# EasyEDA Pro project ProPrj_StepCtlBoard_V1.2_2024-07-15.epro, schematic schematic1

## Sheets
1 P1: Create Date: 2024-05-13; Page Name: P1; Project Name: StepCtlBoard_V1.2; Schematic Name: schematic1; Update Date: 2024-05-18; Company: 嘉立创EDA; Page Size: A4; Version: V1.0
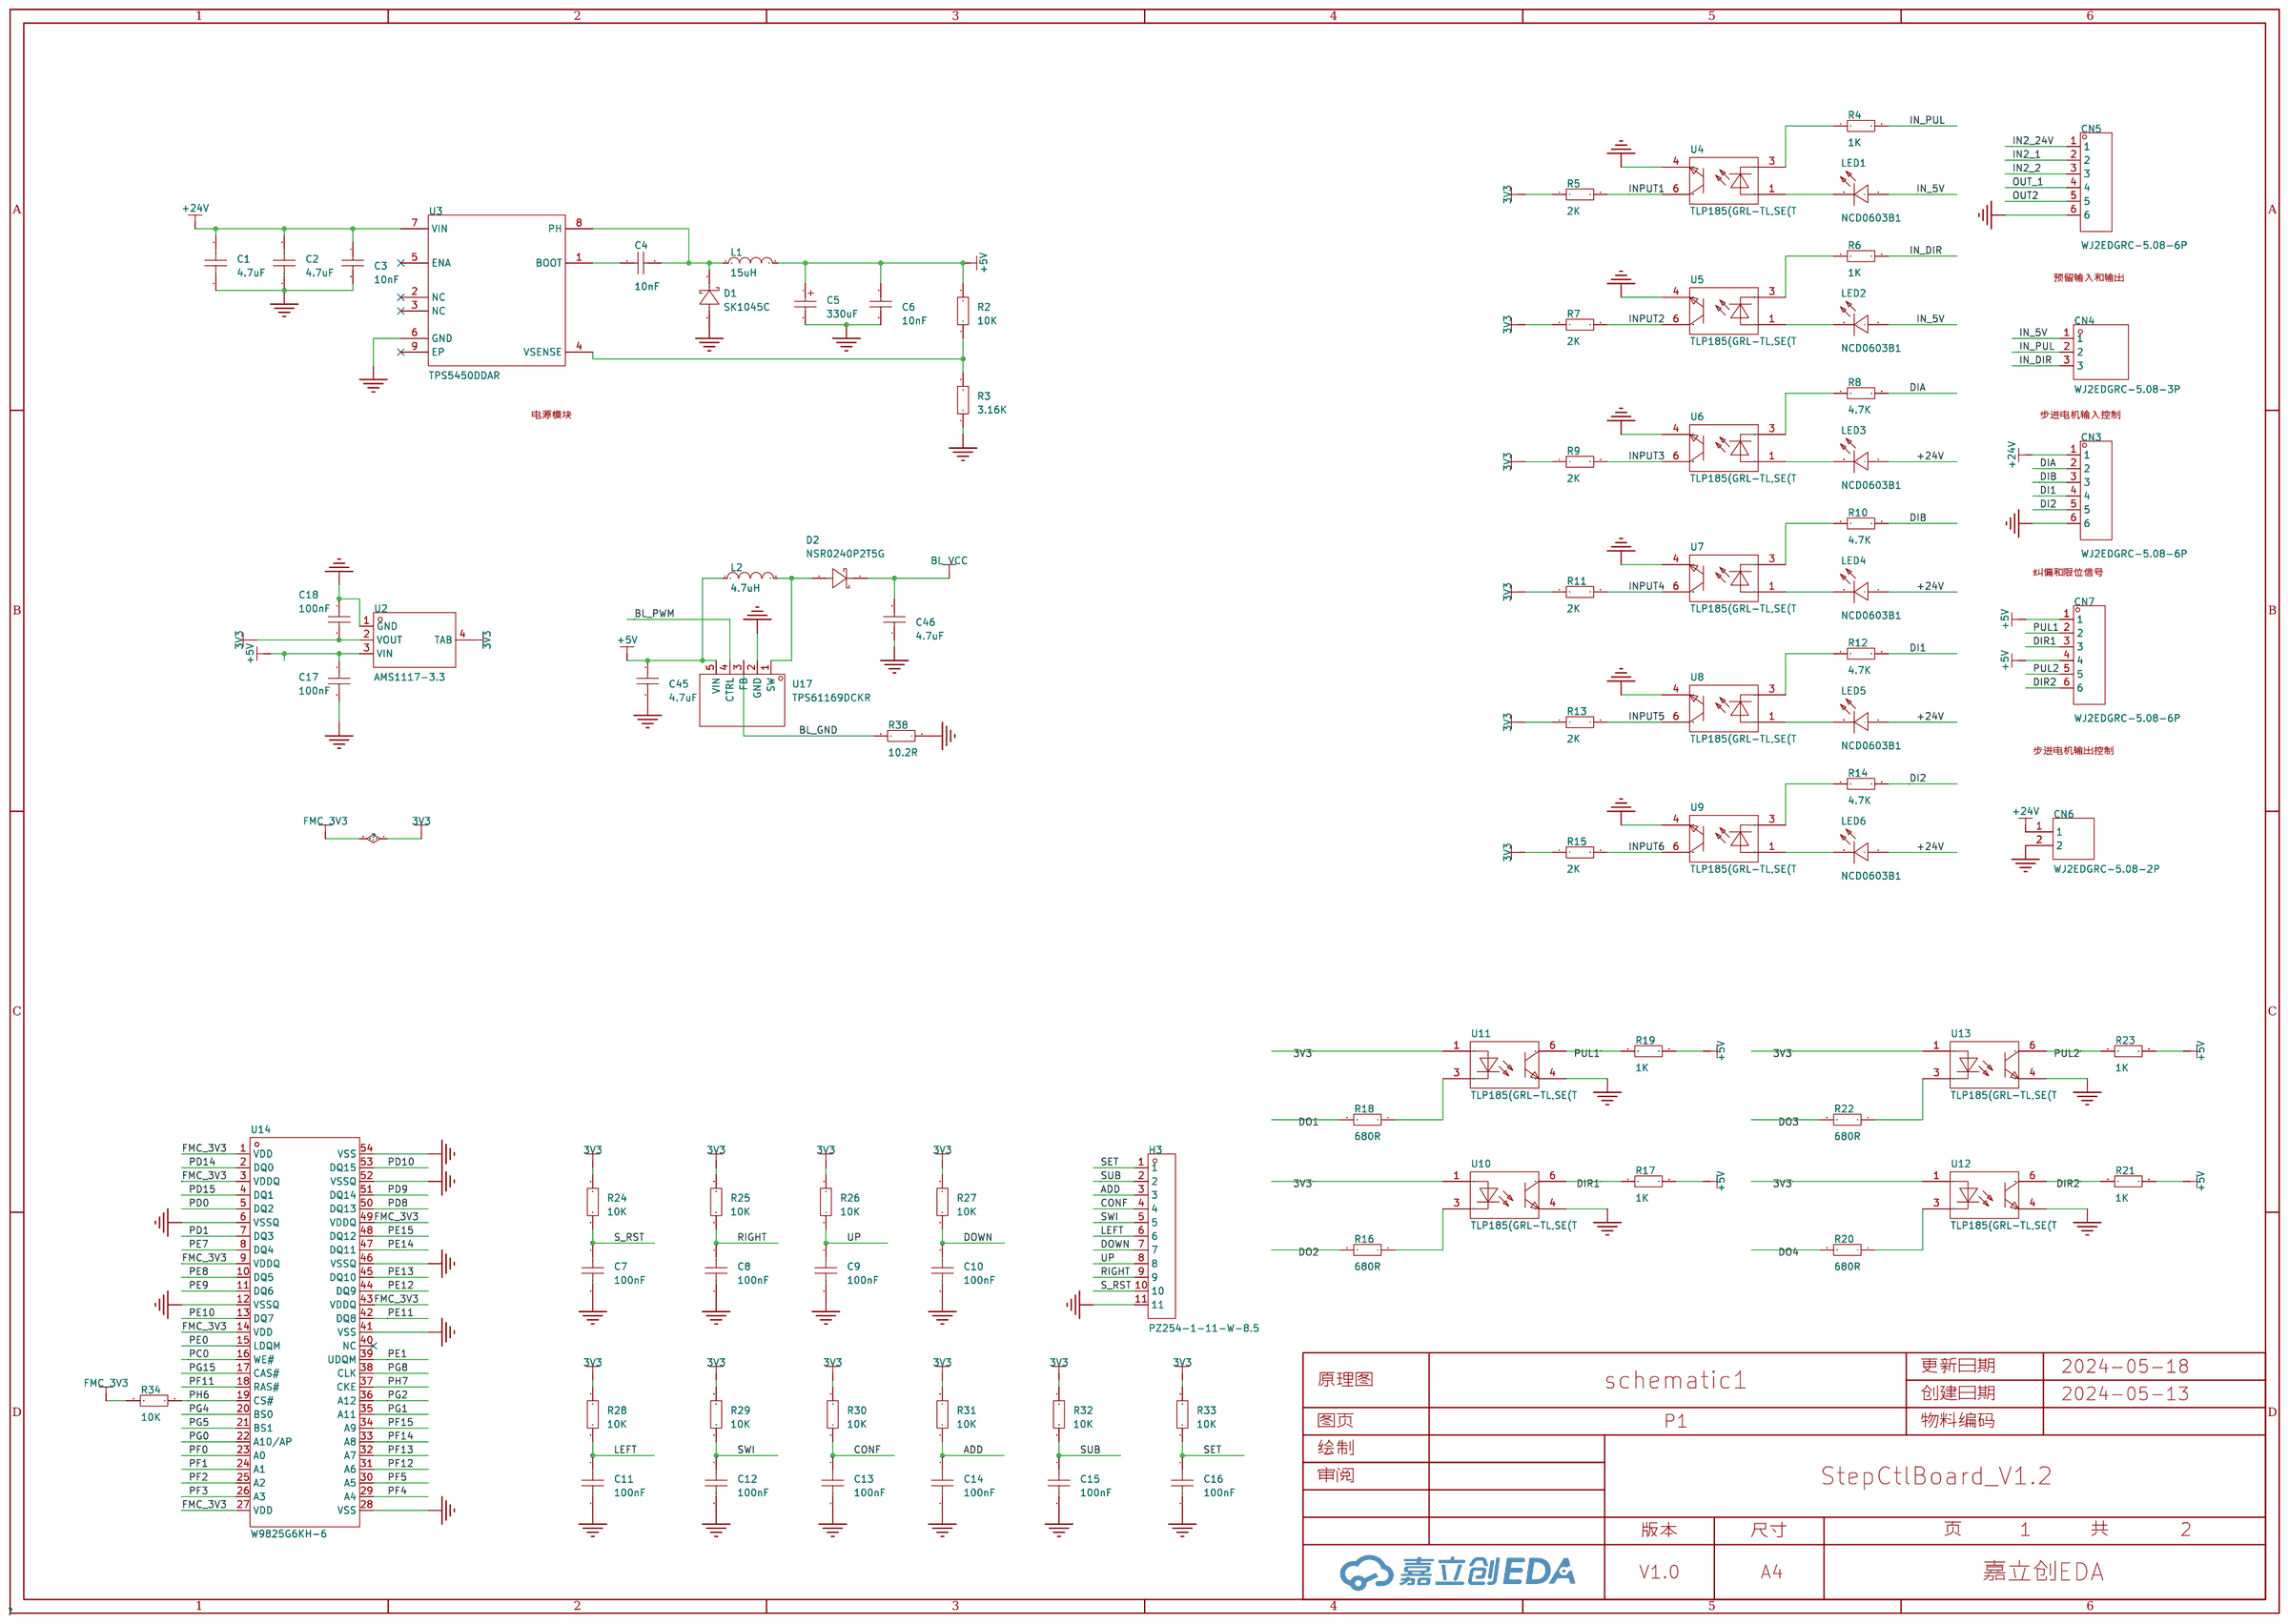
[diagram p0: P1]
2 P2: Create Date: 2024-05-14; Page Name: P2.schematic1; Update Date: 2024-05-26
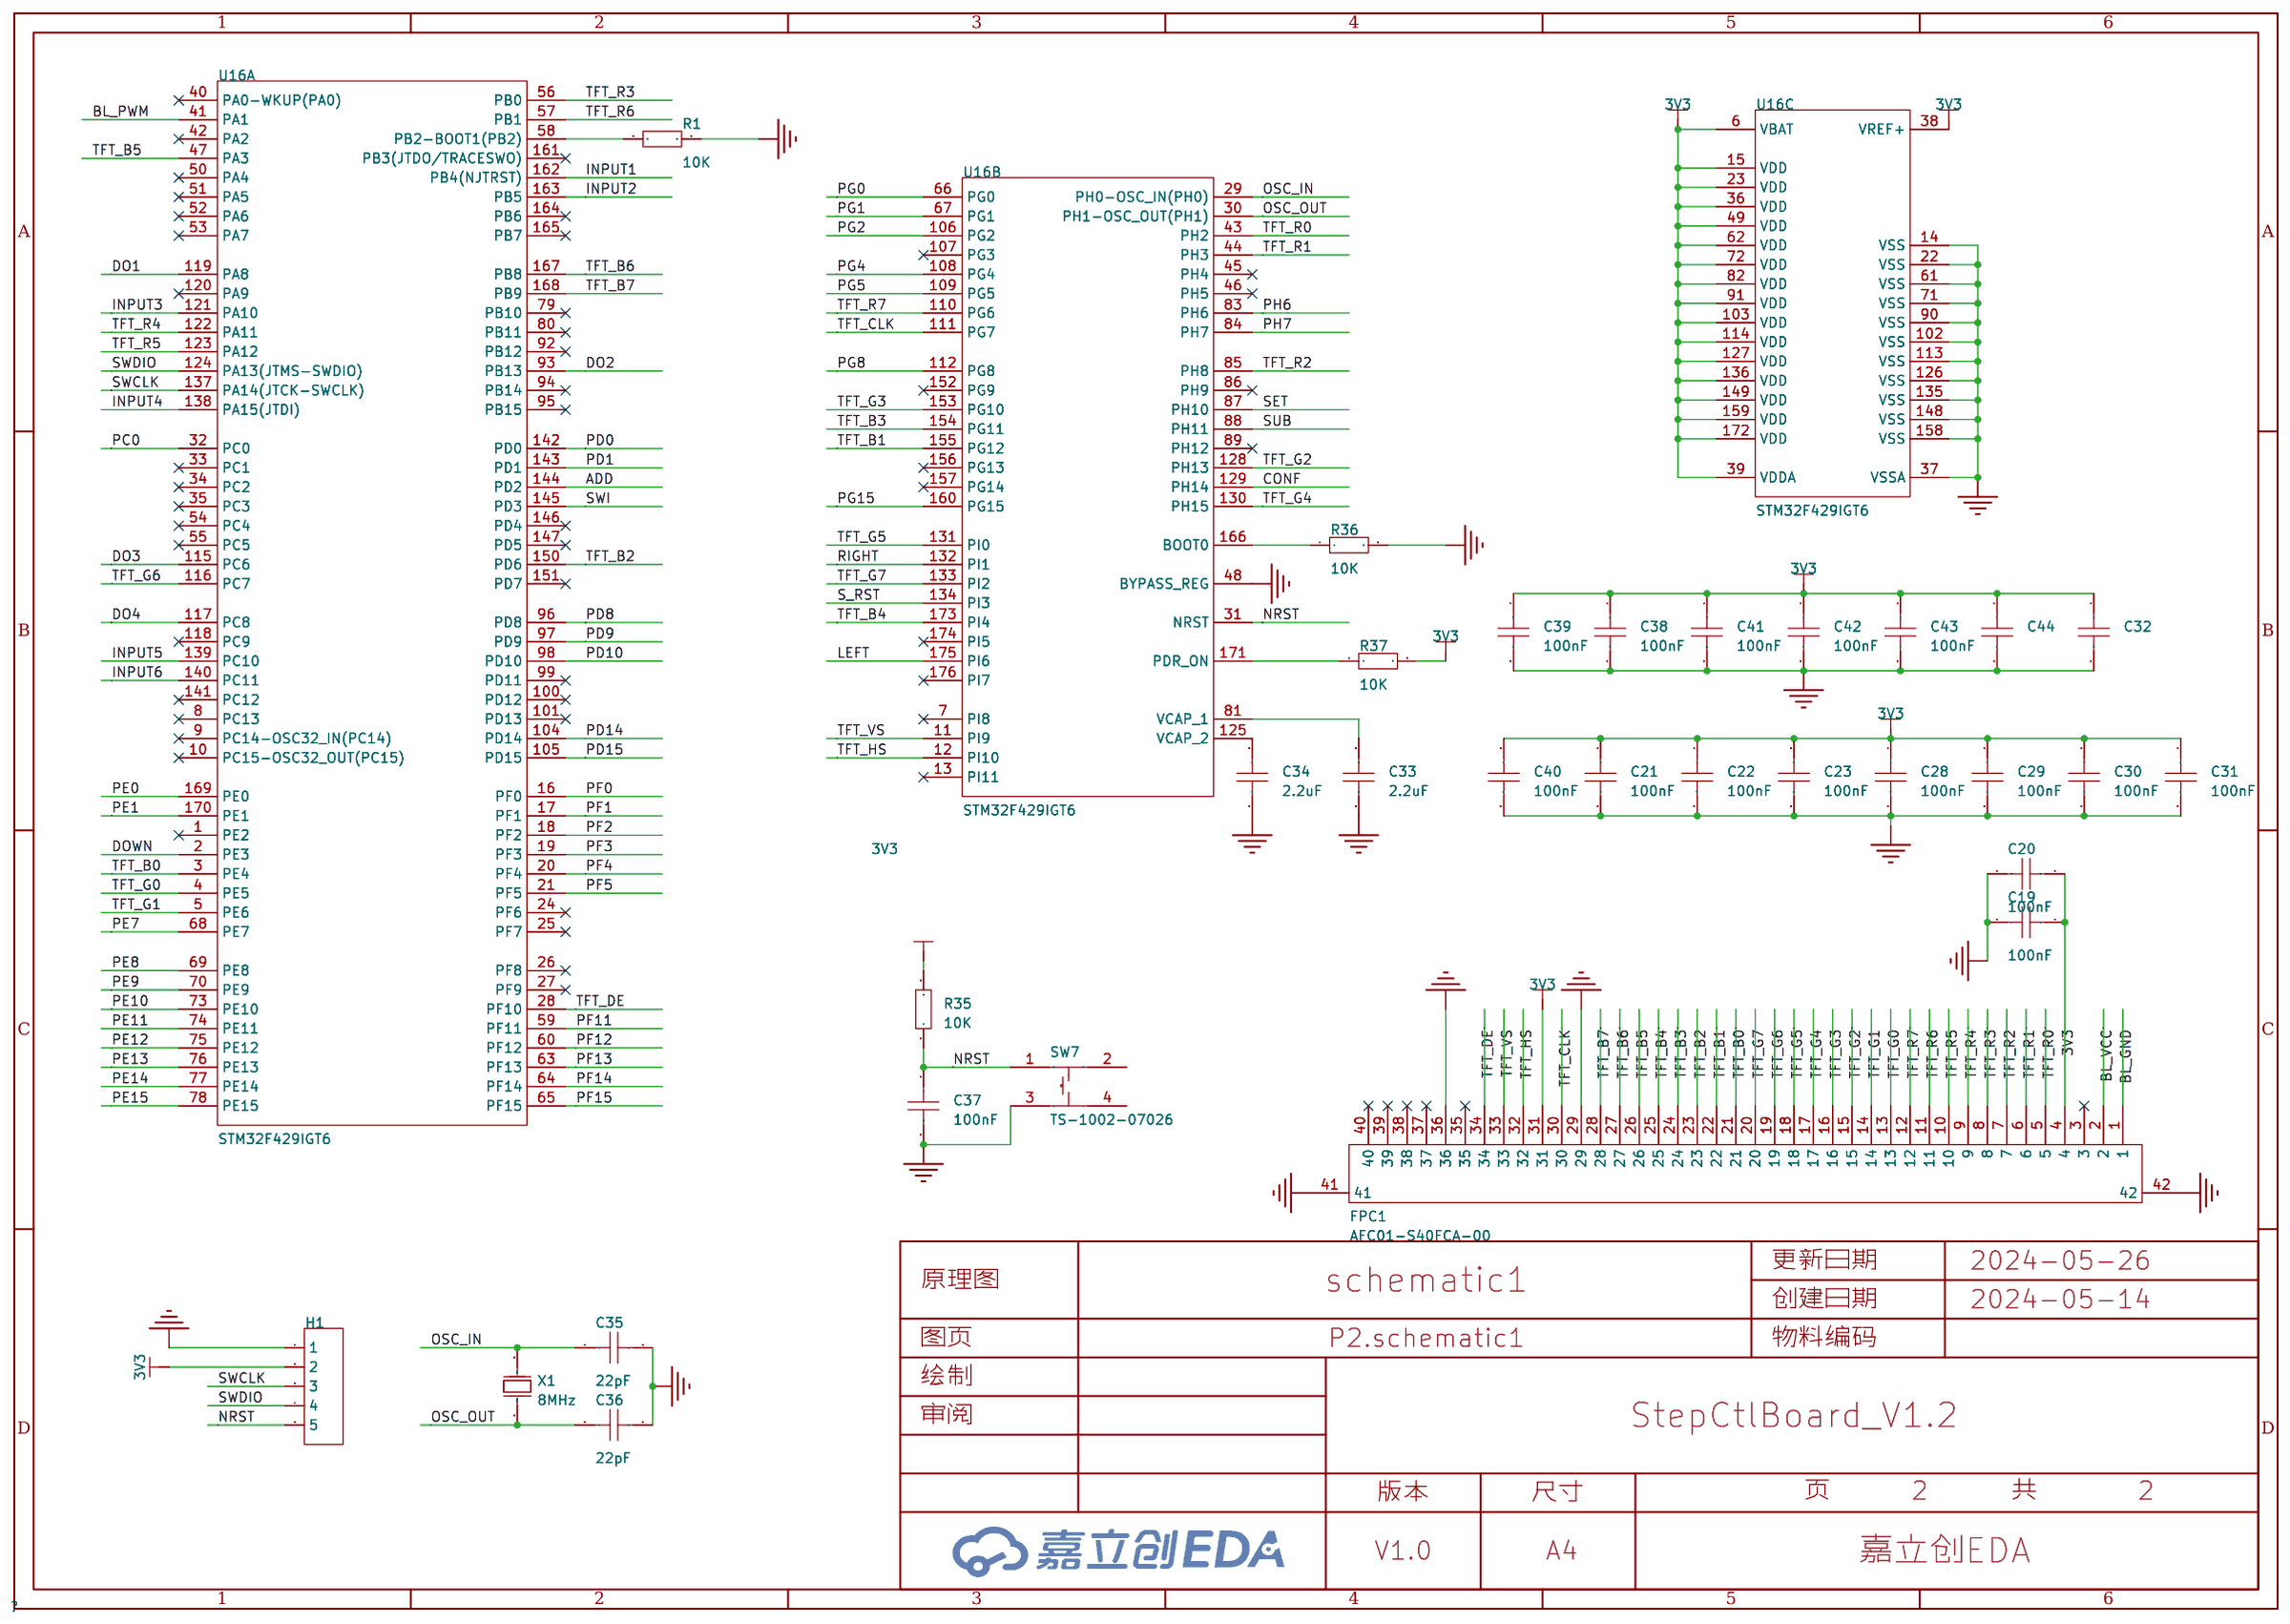
[diagram p1: P2]

## Parts
sheet P1
C1  4.7uF  [C1210]
C2  4.7uF  [C1210]
C3  10nF  [C0603]
C4  10nF  [C0603]
C5  330uF  [CASE-D_7343]
C6  10nF  [C0603]
C7  100nF  [C0603]
C8  100nF  [C0603]
C9  100nF  [C0603]
C10  100nF  [C0603]
C11  100nF  [C0603]
C12  100nF  [C0603]
C13  100nF  [C0603]
C14  100nF  [C0603]
C15  100nF  [C0603]
C16  100nF  [C0603]
C17  100nF  [C0603]
C18  100nF  [C0603]
C45  4.7uF  [C0603]
C46  4.7uF  [C0603]
CN3  WJ2EDGRC-5.08-6P  [CONN-TH_WJ2EDGRC-5.08-6P]
CN4  WJ2EDGRC-5.08-3P  [CONN-TH_3P-P5.08_WJ2EDGRC-5.08-3P]
CN5  WJ2EDGRC-5.08-6P  [CONN-TH_WJ2EDGRC-5.08-6P]
CN6  WJ2EDGRC-5.08-2P  [CONN-TH_2P-P5.08_WJ2EDGRC-5.08-2P]
CN7  WJ2EDGRC-5.08-6P  [CONN-TH_WJ2EDGRC-5.08-6P]
D1  SK1045C  [SMC_L6.9-W5.9-LS7.9-RD]
D2  NSR0240P2T5G  [SOD-923_L0.8-W0.6-LS1.0-RD-1]
H3  PZ254-1-11-W-8.5  [HDR-TH_11P-P2.54-H-M-W10.4-N]
L1  15uH  [IND-SMD_L11.5-W10.0_FXL1040]
L2  4.7uH  [IND-SMD_L4.4-W4.2]
LED1  NCD0603B1  [LED0603-RD]
LED2  NCD0603B1  [LED0603-RD]
LED3  NCD0603B1  [LED0603-RD]
LED4  NCD0603B1  [LED0603-RD]
LED5  NCD0603B1  [LED0603-RD]
LED6  NCD0603B1  [LED0603-RD]
R2  10K  [R0603]
R3  3.16K  [R0603]
R4  1K  [R0603]
R5  2K  [R0603]
R6  1K  [R0603]
R7  2K  [R0603]
R8  4.7K  [R0603]
R9  2K  [R0603]
R10  4.7K  [R0603]
R11  2K  [R0603]
R12  4.7K  [R0603]
R13  2K  [R0603]
R14  4.7K  [R0603]
R15  2K  [R0603]
R16  680R  [R0603]
R17  1K  [R0603]
R18  680R  [R0603]
R19  1K  [R0603]
R20  680R  [R0603]
R21  1K  [R0603]
R22  680R  [R0603]
R23  1K  [R0603]
R24  10K  [R0603]
R25  10K  [R0603]
R26  10K  [R0603]
R27  10K  [R0603]
R28  10K  [R0603]
R29  10K  [R0603]
R30  10K  [R0603]
R31  10K  [R0603]
R32  10K  [R0603]
R33  10K  [R0603]
R34  10K  [R0603]
R38  10.2R  [R0603]
U2  AMS1117-3.3  [SOT-223-3_L6.5-W3.5-P3.05-LS7.0]
U3  TPS5450DDAR  [soic-8_l5.3-w3.9-p1.27-ls6.0-bl]
U4  TLP185(GRL-TL,SE(T  [SOIC-4_L3.6-W4.4-P2.54-LS7.0-TL]
U5  TLP185(GRL-TL,SE(T  [SOIC-4_L3.6-W4.4-P2.54-LS7.0-TL]
U6  TLP185(GRL-TL,SE(T  [SOIC-4_L3.6-W4.4-P2.54-LS7.0-TL]
U7  TLP185(GRL-TL,SE(T  [SOIC-4_L3.6-W4.4-P2.54-LS7.0-TL]
U8  TLP185(GRL-TL,SE(T  [SOIC-4_L3.6-W4.4-P2.54-LS7.0-TL]
U9  TLP185(GRL-TL,SE(T  [SOIC-4_L3.6-W4.4-P2.54-LS7.0-TL]
U10  TLP185(GRL-TL,SE(T  [SOIC-4_L3.6-W4.4-P2.54-LS7.0-TL]
U11  TLP185(GRL-TL,SE(T  [SOIC-4_L3.6-W4.4-P2.54-LS7.0-TL]
U12  TLP185(GRL-TL,SE(T  [SOIC-4_L3.6-W4.4-P2.54-LS7.0-TL]
U13  TLP185(GRL-TL,SE(T  [SOIC-4_L3.6-W4.4-P2.54-LS7.0-TL]
U14  W9825G6KH-6  [TSOP-54_L22.2-W10.2-P0.80-LS11.8-BL]
U17  TPS61169DCKR  [SC-70-5_L2.1-W1.3-P0.65-LS2.1-BR]
sheet P2
C19  100nF  [C0603]
C20  100nF  [C0603]
C21  100nF  [C0603]
C22  100nF  [C0603]
C23  100nF  [C0603]
C28  100nF  [C0603]
C29  100nF  [C0603]
C30  100nF  [C0603]
C31  100nF  [C0603]
C32  100nF  [C0603]
C33  2.2uF  [C0603]
C34  2.2uF  [C0603]
C35  22pF  [C0603]
C36  22pF  [C0603]
C37  100nF  [C0603]
C38  100nF  [C0603]
C39  100nF  [C0603]
C40  100nF  [C0603]
C41  100nF  [C0603]
C42  100nF  [C0603]
C43  100nF  [C0603]
C44  100nF  [C0603]
FPC1  AFC01-S40FCA-00  [FPC-SMD_P0.50-40P_FGS-XJ-H2.0]
H1  -  [HDR-TH_5P-P2.54-V-F]
R1  10K  [R0603]
R35  10K  [R0603]
R36  10K  [R0603]
R37  10K  [R0603]
SW7  TS-1002-07026  [SW-TH_4P-L6.0-W6.0-P4.50-LS6.5]
U16  STM32F429IGT6  [LQFP-176_L24.0-W24.0-P0.50-LS26.0-BL]  (sections 1,2,3)
X1  8MHz  [CRYSTAL-SMD_L5.0-W3.2]

## Library data of the parts
C1 C2 = GRM32ER71H475KA88L: 容值:4.7uF;精度:±10%;额定电压:50V;材质(温度系数):X7R;; LCSC Part Name: 4.7uF ±10% 50V; Supplier Part: C86052; Manufacturer: muRata(村田); Supplier Footprint: 1210; JLCPCB Part Class: 扩展库; Datasheet: https://atta.szlcsc.com/upload/public/pdf/source/20200305/C490387_23319AE8C154DEB24C505E6C82A8106A.pdf; Supplier: LCSC; Tolerance: ±10%; Voltage Rated: 50V; Temperature Coefficient: X7R
C3 C4 C6 C17 C18 C45 C46 = CC0603KRX7R9BB103: 容值:10nF;精度:±10%;额定电压:50V;材质(温度系数):X7R;; LCSC Part Name: 10nF ±10% 50V; Supplier Part: C100042; Manufacturer: YAGEO(国巨); Supplier Footprint: 0603; JLCPCB Part Class: 扩展库; Datasheet: https://atta.szlcsc.com/upload/public/pdf/source/20181008/C309510_22F155564471FAF6A489F7D68F34234E.pdf; Supplier: LCSC; Tolerance: ±10%; Voltage Rated: 50V; Temperature Coefficient: X7R
C5 = TAJD337K010RNJ: 容值:330uF;精度:±10%;额定电压:10V;等效串联电阻:900mΩ@100kHz;; LCSC Part Name: 330uF ±10% 10V; Supplier Part: C7226; Manufacturer: Kyocera AVX; Supplier Footprint: CASE-D-7343; JLCPCB Part Class: 扩展库; Datasheet: https://atta.szlcsc.com/upload/public/pdf/source/20160107/1457707750344.pdf; Supplier: LCSC; Tolerance: ±10%; Rated Voltage: 10V; Equivalent Series Resistance(ESR): 900mΩ@100kHz; Operating Temperature: -55℃~+125℃
C7-C16 C19-C23 C28-C44 = CAP_0603: Supplier Footprint: 0603
CN3 CN5 CN7 = WJ2EDGRC-5.08-6P: 连接器类型:板端/插座-闭口;结构:1x6P;间距:5.08mm;颜色:绿色;安装方式:弯针;排数:1;每排PIN数:6;; LCSC Part Name: 5.08mm 1x6P 排数:1 每排P数:6; Supplier Part: C8435; Manufacturer: KANGNEX(康奈克斯电气); Supplier Footprint: 弯插,P=5.08mm; JLCPCB Part Class: 扩展库; Datasheet: https://atta.szlcsc.com/upload/public/pdf/source/20191225/C8435_59EFB41A73925F682C4DC0DCD9FD0EA1.pdf; Supplier: LCSC; Connector Type: 板端/插座-闭口; Structure: 1x6P; Pitch: 5.08mm; Color: 绿色; Mounting Style: 弯针; Number of Pins: 6P; Number of Rows: 1; Number of PINs Per Row: 6
CN4 = WJ2EDGRC-5.08-3P: 连接器类型:板端/插座-闭口;结构:1x3P;间距:5.08mm;颜色:绿色;安装方式:弯针;排数:1;每排PIN数:3;; LCSC Part Name: 5.08mm 1x3P 排数:1 每排P数:3; Supplier Part: C8377; Manufacturer: KANGNEX(康奈克斯电气); Supplier Footprint: 弯插,P=5.08mm; JLCPCB Part Class: 扩展库; Datasheet: https://atta.szlcsc.com/upload/public/pdf/source/20191225/C8377_E9604AE22C0149806E1C09B398404CFA.pdf; Supplier: LCSC; Connector Type: 板端/插座-闭口; Structure: 1x3P; Pitch: 5.08mm; Color: 绿色; Mounting Style: 弯针; Number of Pins: 3P; Number of Rows: 1; Number of PINs Per Row: 3
CN6 = WJ2EDGRC-5.08-2P: 连接器类型:板端/插座-闭口;结构:1x2P;间距:5.08mm;颜色:绿色;安装方式:弯针;排数:1;每排PIN数:2;; LCSC Part Name: 5.08mm 1x2P 排数:1 每排P数:2; Supplier Part: C3697; Manufacturer: KANGNEX(康奈克斯电气); Supplier Footprint: 弯插,P=5.08mm; JLCPCB Part Class: 扩展库; Datasheet: https://atta.szlcsc.com/upload/public/pdf/source/20191225/C3697_6E7B45CD3FD3DA2CDF6A2CE707235E10.pdf; Supplier: LCSC; Connector Type: 板端/插座-闭口; Structure: 1x2P; Pitch: 5.08mm; Color: 绿色; Mounting Style: 弯针; Number of Pins: 2P; Number of Rows: 1; Number of PINs Per Row: 2
D1 = SK1045C_C18199212: 二极管配置:独立式;正向压降(Vf):550mV@10A;直流反向耐压(Vr):45V;平均整流电流(Io):10A;; LCSC Part Name: 电压:45V 电流:10A; Supplier Part: C18199212; Manufacturer: 宏迦橙; Supplier Footprint: SMC; Datasheet: https://atta.szlcsc.com/upload/public/pdf/source/20230925/90F2340DC9BC2B2517F18AABBBD1A464.pdf; Supplier: LCSC; Diode Configuration: 独立式; Forward Voltage (Vf@If): 550mV@10A; Reverse Voltage (Vr): 45V; Average Rectified Current (Io): 10A; Reverse Leakage Current (Ir): 500uA@45V; Peak forward surge current: 175A
D2 = NSR0240P2T5G: 二极管配置:独立式;正向压降(Vf):540mV@200mA;直流反向耐压(Vr):40V;平均整流电流(Io):200mA;; LCSC Part Name: 电压:40V 电流:200mA; Supplier Part: C896425; Manufacturer: onsemi(安森美); Supplier Footprint: SOD-923; JLCPCB Part Class: 扩展库; Datasheet: https://atta.szlcsc.com/upload/public/pdf/source/20210322/C896425_1C81ED597E7FB0E647376563957F71FC.pdf; Supplier: LCSC; Diode Configuration: 独立式; Forward Voltage (Vf@If): 540mV@200mA; Reverse Voltage (Vr): 40V; Average Rectified Current (Io): 200mA; Reverse Leakage Current (Ir): 5uA@40V
H3 = PZ254-1-11-W-8.5: 插针结构:1x11P;间距:2.54mm;行距:-;圆针/方针:方针;安装类型:弯插;排数:单排;总PIN位数:11P;额定电流:3A;额定电压:-;配合针长度:6mm;塑高:2.5mm;端接针长度:-;触头材质:-;工作温度范围:-40℃~+105℃;焊接温度(最大值):260℃@10S;颜色:黑色;; LCSC Part Name: 1x11P 间距:2.54mm 方针 弯插; Supplier Part: C2894953; Manufacturer: HCTL(华灿天禄); Supplier Footprint: 弯插,P=2.54mm; JLCPCB Part Class: 扩展库; Datasheet: https://atta.szlcsc.com/upload/public/pdf/source/20230609/872AF364EDF8DB2CAF0930EAB94ECB6E.pdf; Supplier: LCSC; Pin Structure: 1x11P; Pitch: 2.54mm; Circluar Pins/Square Pins: 方针; Mounting Type: 弯插; Number of Rows: 单排; Number of Pins: 11P; Current Rating (Max): 3A; Length of Mating Pin: 6mm; Insulation Height: 2.5mm; Operating Temperature Range: -40℃~+105℃; Soldering Temperature(Max): 260℃@10S; Color: 黑色
L1 = FXL1040-150-M: 电感值:15uH;精度:±20%;额定电流:6.5A;饱和电流(Isat):7A;类型:一体成型电感;; LCSC Part Name: 15uH ±20% 7A; Supplier Part: C475916; Manufacturer: cjiang(长江微电); Supplier Footprint: SMD,11.5x10mm; JLCPCB Part Class: 扩展库; Datasheet: https://atta.szlcsc.com/upload/public/pdf/source/20230516/54757DC4DB76FADFA619F78143C06647.pdf; Supplier: LCSC; Tolerance: ±20%; Rated Current: 6.5A; Saturation Current (Isat): 7A; DC Resistance (DCR): 45mΩ; Type: 一体成型电感
L2 = FXL0420-4R7-M: 电感值:4.7uH;精度:±20%;额定电流:2.8A;饱和电流(Isat):3A;类型:一体成型电感;; LCSC Part Name: 4.7uH ±20% 3A; Supplier Part: C167208; Manufacturer: cjiang(长江微电); Supplier Footprint: SMD,4.2x4.4mm; JLCPCB Part Class: 扩展库; Datasheet: https://atta.szlcsc.com/upload/public/pdf/source/20230516/FBADA9890E7FBE97C620F1D8B562D733.pdf; Supplier: LCSC; Tolerance: ±20%; Rated Current: 2.8A; Saturation Current (Isat): 3A; DC Resistance (DCR): 105mΩ; Type: 一体成型电感
LED1-LED6 = NCD0603B1: 发光颜色:蓝色;正向电压(VF):2.6V~3.6V;功率:72mW;正向电流:10mA;主波长:463nm~475nm;透镜颜色:无色透明透镜;发光强度:80mcd~220mcd;发光角度:130°;工作温度:-30℃~+85℃;; Supplier Part: C84266; Manufacturer: 国星光电; Supplier Footprint: 0603; JLCPCB Part Class: Extended Part; Datasheet: https://atta.szlcsc.com/upload/public/pdf/source/20200820/C84266_6A3CDBEFA72C6CAD68EDA53474ADAE6C.pdf; Supplier: LCSC; Emitted Color: 蓝色; Forward Voltage (VF): 2.6V~3.6V; Power Dissipation: 72mW; Forward Current: 10mA; Dominant Wavelength: 463nm~475nm; Lens Color: 无色透明透镜; Luminous Intensity: 80mcd~220mcd; Viewing Angle: 130°; Operating Temperature: -30℃~+85℃; Diode Configuration: 独立二极管
R1-R38 = Res_0603: Supplier Footprint: 0603
U2 = AMS1117-3.3_C5250992: 输出类型：固定 输出极性：正 最大输入电压：18V 输出电压：3.3V 输出电流：1A 电源纹波抑制比(PSRR)：60dB@(120Hz)。当前应用较多领域：三端稳压器，机顶盒; Supplier Part: C5250992; Manufacturer: TWGMC(台湾迪嘉); Supplier Footprint: SOT-223-3L; JLCPCB Part Class: 扩展库; Datasheet: https://atta.szlcsc.com/upload/public/pdf/source/20221109/A58A92B07670E85D28928AE371260E8D.pdf; Supplier: LCSC
U3 = TPS5450DDAR: 功能类型:降压型;输出类型:可调;输入电压:5.5V~36V;输出电压:1.221V~31.32V;输出电流(最大值):5A;; Supplier Part: C114425; Manufacturer: TI(德州仪器); Supplier Footprint: SOP-8-EP-150mil; JLCPCB Part Class: 扩展库; Datasheet: https://www.ti.com/cn/lit/gpn/tps5450; Supplier: LCSC; Function: 降压型; Output Type: 可调; Input Voltage: 5.5V~36V; Output Voltage: 1.221V~31.32V; Output Current (Max): 5A; Switching Frequency: 500kHz; Operating Temperature: -40℃~+125℃@(TJ); Synchronous Rectification: 否; Number of Outputs: 1; Topology: 降压式; Switch tube (built-in/external): 内置
U4-U13 = TLP185(GRL-TL,SE(T: Supplier Part: C2848499; Manufacturer: TOSHIBA(东芝); Supplier Footprint: SOP-4; JLCPCB Part Class: 扩展库; Supplier: LCSC
U14 = W9825G6KH-6: Supplier Part: C62246; Manufacturer: WINBOND(华邦); Supplier Footprint: TSOP-54-10.2mm; JLCPCB Part Class: 扩展库; Datasheet: https://atta.szlcsc.com/upload/public/pdf/source/20170316/1489630415513.pdf; Supplier: LCSC
U17 = TPS61169DCKR: 类型:DC-DC稳压器;输入电压:2.7V~5.5V;开关频率:1.2MHz;通道数:1;输出电流:1.8A;调光:PWM;拓扑结构:升压;; Supplier Part: C71045; Manufacturer: TI(德州仪器); Supplier Footprint: SC-70-5; JLCPCB Part Class: 扩展库; Datasheet: https://www.ti.com/cn/lit/gpn/tps61169; Supplier: LCSC; Type: DC-DC稳压器; Input Voltage: 2.7V~5.5V; Switch Frequency: 1.2MHz; Channels: 1; Output Current: 1.8A; Dimming: PWM; Topology: 升压; Operating temperature: -40℃~+125℃
FPC1 = AFC01-S40FCA-00: 锁定特性:翻盖式;触点类型:下接;触点数量:40P;间距:0.5mm;安装类型:卧贴;; LCSC Part Name: 间距:0.5mm P数:40P 翻盖式 下接; Supplier Part: C262674; Manufacturer: JS(钜硕电子); Supplier Footprint: SMD,P=0.5mm,卧贴; JLCPCB Part Class: 扩展库; Datasheet: https://atta.szlcsc.com/upload/public/pdf/source/20190816/C413942_2A72D1AC756EAE17EEDF756A339D4500.pdf; Supplier: LCSC; Locking Feature: 翻盖式; Contact Type: 下接; Number of Contacts: 40P; Pitch: 0.5mm; Mounting Type: 卧贴; FFC, FCB Thickness: 0.3mm; Height Above Board: 2mm
H1 = HDR-F_2.54_1x5P: Supplier Part: C50950; Supplier Footprint: 插件
SW7 = TS-1002-07026: 电路结构:单刀单掷;按钮形状:圆形按钮;安装方式:直插;开关长度:6mm;开关宽度:6mm;开关高度:7mm;触点电流:50mA;额定电压(DC):12V;带灯:-;机械寿命:-;; LCSC Part Name: 6*6*7mm 直插 轻触开关; Supplier Part: C455095; Manufacturer: XUNPU(讯普); Supplier Footprint: 插件,6x6mm; JLCPCB Part Class: 扩展库; Datasheet: https://atta.szlcsc.com/upload/public/pdf/source/20231108/52BC6409AB52B6746CCC051A15664904.pdf; Supplier: LCSC; Circuit: 单刀单掷; Actuator Style: 圆形按钮; Mounting Style: 直插; Switch Length: 6mm; Switch Width: 6mm; Switch Height: 7mm; Contact Current: 50mA; Voltage Rating (DC): 12V
U16 = STM32F429IGT6: CPU内核:CM4;程序存储容量:1MB;RAM总容量:256KB;GPIO端口数量:140;工作电压范围:1.8V~3.6V;CPU最大主频:180MHz;程序存储器类型:FLASH;; Supplier Part: C54328; Manufacturer: ST(意法半导体); Supplier Footprint: LQFP-176(24x24); JLCPCB Part Class: 扩展库; Datasheet: https://atta.szlcsc.com/upload/public/pdf/source/20170102/1483323670635.pdf; Supplier: LCSC; CPU Core: CM4; Program Storage Size: 1MB; RAM Size: 256KB; GPIO Ports Number: 140; Operating Voltage Range: 1.8V~3.6V; CPU Maximum Speed: 180MHz; Program Memory Type: FLASH; Operating Temperature Range: -40℃~+85℃; ADC (Bit): 12bit; DAC (Bit): 12bit; Universal Serial Bus: 有; Peripheral/Function: DMA；LCD/LED驱动；PWM; Watchdog: 有; Infrared Data Association: 有; Low-Voltage Detect: 有; LCD Module: 有; Direct Memory Access: 有; Internal Oscillator: 有
X1 = X50328MSB2GI: 晶振类型:贴片晶振;频率:8MHz;常温频差:±10ppm;外接负载电容:20pF;频率稳定度(全温):±50ppm;; LCSC Part Name: 8MHz ±10ppm 20pF YSX530GA; Supplier Part: C115962; Manufacturer: YXC(扬兴晶振); Supplier Footprint: SMD5032; JLCPCB Part Class: 基础库; Datasheet: https://atta.szlcsc.com/upload/public/pdf/source/20230220/0EBFFB9D6D8CE6A211407822BBB6C516.pdf; Supplier: LCSC; Crystal Type: 贴片晶振; Normal temperature Frequency Tolerance: ±10ppm; External load capacitor: 20pF; Frequency Stability(Full temperature range): ±50ppm; Operating Temperature: -40℃~+85℃

## Nets
3V3: C18.2 C19.1 C20.1 C21.1 C22.1 C23.1 C28.1 C29.1 C30.1 C31.1 C32.1 C38.1 C39.1 C40.1 C41.1 C42.1 C43.1 C44.1 FPC1.4 FPC1.31 H1.2 R5.1 R7.1 R9.1 R11.1 R13.1 R15.1 R24.2 R25.2 R26.2 R27.2 R28.2 R29.2 R30.2 R31.2 R32.2 R33.2 R34.1 R35.2 R37.2 U2.2(VOUT) U2.4(TAB) U10.1(AN) U11.1(AN) U12.1(AN) U13.1(AN) U14.1(VDD) U14.3(VDDQ) U14.9(VDDQ) U14.14(VDD) U14.27(VDD) U14.43(VDDQ) U14.49(VDDQ) U16.6(VBAT) U16.15(VDD) U16.23(VDD) U16.36(VDD) U16.38(VREF+) U16.39(VDDA) U16.49(VDD) U16.62(VDD) U16.72(VDD) U16.82(VDD) U16.91(VDD) U16.103(VDD) U16.114(VDD) U16.127(VDD) U16.136(VDD) U16.149(VDD) U16.159(VDD) U16.172(VDD)
+5V: C5.1 C6.2 C17.1 C45.2 CN7.1 CN7.4 L1.2 L2.1 R2.2 R17.1 R19.1 R21.1 R23.1 U2.3(VIN) U17.5(VIN)
+24V: C1.2 C2.2 C3.1 CN3.1 CN6.1 LED3.1(+) LED4.1(+) LED5.1(+) LED6.1(+) U3.7(VIN)
GND: C1.1 C2.1 C3.2 C5.2 C6.1 C7.2 C8.2 C9.2 C10.2 C11.2 C12.2 C13.2 C14.2 C15.2 C16.2 C17.2 C18.1 C19.2 C20.2 C21.2 C22.2 C23.2 C28.2 C29.2 C30.2 C31.2 C32.2 C33.1 C34.1 C35.2 C36.2 C37.2 C38.2 C39.2 C40.2 C41.2 C42.2 C43.2 C44.2 C45.1 C46.1 CN3.6 CN5.6 CN6.2 D1.2(A) FPC1.29 FPC1.36 FPC1.41 FPC1.42 H1.1 H3.11 R1.2 R3.1 R36.2 R38.1 SW7.3 U2.1(GND) U3.6(GND) U4.4(EMI) U5.4(EMI) U6.4(EMI) U7.4(EMI) U8.4(EMI) U9.4(EMI) U10.4(EMI) U11.4(EMI) U12.4(EMI) U13.4(EMI) U14.6(VSSQ) U14.12(VSSQ) U14.28(VSS) U14.41(VSS) U14.46(VSSQ) U14.52(VSSQ) U14.54(VSS) U16.14(VSS) U16.22(VSS) U16.37(VSSA) U16.48(BYPASS_REG) U16.61(VSS) U16.71(VSS) U16.90(VSS) U16.102(VSS) U16.113(VSS) U16.126(VSS) U16.135(VSS) U16.148(VSS) U16.158(VSS) U17.2(GND)
ADD: C14.1 H3.3 R31.1 U16.144(PD2)
BL_GND: FPC1.1 R38.2 U17.3(FB)
BL_PWM: U16.41(PA1) U17.4(CTRL)
BL_VCC: C46.2 D2.1(C) FPC1.2
CONF: C13.1 H3.4 R30.1 U16.129(PH14)
DI1: CN3.4 R12.2
DI2: CN3.5 R14.2
DIA: CN3.2 R8.2
DIB: CN3.3 R10.2
DIR1: CN7.3 R17.2 U10.6(COL)
DIR2: CN7.6 R21.2 U12.6(COL)
DO1: R18.2 U16.119(PA8)
DO2: R16.2 U16.93(PB13)
DO3: R22.2 U16.115(PC6)
DO4: R20.2 U16.117(PC8)
DOWN: C10.1 H3.7 R27.1 U16.2(PE3)
IN2_1: CN5.2
IN2_2: CN5.3
IN2_24V: CN5.1
IN_5V: CN4.1 LED1.1(+) LED2.1(+)
IN_DIR: CN4.3 R6.2
IN_PUL: CN4.2 R4.2
INPUT1: R5.2 U4.6(COL) U16.162(PB4(NJTRST))
INPUT2: R7.2 U5.6(COL) U16.163(PB5)
INPUT3: R9.2 U6.6(COL) U16.121(PA10)
INPUT4: R11.2 U7.6(COL) U16.138(PA15(JTDI))
INPUT5: R13.2 U8.6(COL) U16.139(PC10)
INPUT6: R15.2 U9.6(COL) U16.140(PC11)
LEFT: C11.1 H3.6 R28.1 U16.175(PI6)
NRST: C37.1 H1.5 R35.1 SW7.1 U16.31(NRST)
OSC_IN: C35.1 U16.29(PH0-OSC_IN(PH0)) X1.2(OSC2)
OSC_OUT: C36.1 U16.30(PH1-OSC_OUT(PH1)) X1.1(OSC1)
OUT2: CN5.5
OUT_1: CN5.4
PC0: U14.16(WE#) U16.32(PC0)
PD0: U14.5(DQ2) U16.142(PD0)
PD1: U14.7(DQ3) U16.143(PD1)
PD8: U14.50(DQ13) U16.96(PD8)
PD9: U14.51(DQ14) U16.97(PD9)
PD10: U14.53(DQ15) U16.98(PD10)
PD14: U14.2(DQ0) U16.104(PD14)
PD15: U14.4(DQ1) U16.105(PD15)
PE0: U14.15(LDQM) U16.169(PE0)
PE1: U14.39(UDQM) U16.170(PE1)
PE7: U14.8(DQ4) U16.68(PE7)
PE8: U14.10(DQ5) U16.69(PE8)
PE9: U14.11(DQ6) U16.70(PE9)
PE10: U14.13(DQ7) U16.73(PE10)
PE11: U14.42(DQ8) U16.74(PE11)
PE12: U14.44(DQ9) U16.75(PE12)
PE13: U14.45(DQ10) U16.76(PE13)
PE14: U14.47(DQ11) U16.77(PE14)
PE15: U14.48(DQ12) U16.78(PE15)
PF0: U14.23(A0) U16.16(PF0)
PF1: U14.24(A1) U16.17(PF1)
PF2: U14.25(A2) U16.18(PF2)
PF3: U14.26(A3) U16.19(PF3)
PF4: U14.29(A4) U16.20(PF4)
PF5: U14.30(A5) U16.21(PF5)
PF11: U14.18(RAS#) U16.59(PF11)
PF12: U14.31(A6) U16.60(PF12)
PF13: U14.32(A7) U16.63(PF13)
PF14: U14.33(A8) U16.64(PF14)
PF15: U14.34(A9) U16.65(PF15)
PG0: U14.22(A10/AP) U16.66(PG0)
PG1: U14.35(A11) U16.67(PG1)
PG2: U14.36(A12) U16.106(PG2)
PG4: U14.20(BS0) U16.108(PG4)
PG5: U14.21(BS1) U16.109(PG5)
PG8: U14.38(CLK) U16.112(PG8)
PG15: U14.17(CAS#) U16.160(PG15)
PH6: R34.2 U14.19(CS#) U16.83(PH6)
PH7: U14.37(CKE) U16.84(PH7)
PUL1: CN7.2 R19.2 U11.6(COL)
PUL2: CN7.5 R23.2 U13.6(COL)
RIGHT: C8.1 H3.9 R25.1 U16.132(PI1)
S_RST: C7.1 H3.10 R24.1 U16.134(PI3)
SET: C16.1 H3.1 R33.1 U16.87(PH10)
SUB: C15.1 H3.2 R32.1 U16.88(PH11)
SWCLK: H1.3 U16.137(PA14(JTCK-SWCLK))
SWDIO: H1.4 U16.124(PA13(JTMS-SWDIO))
SWI: C12.1 H3.5 R29.1 U16.145(PD3)
TFT_B0: FPC1.21 U16.3(PE4)
TFT_B1: FPC1.22 U16.155(PG12)
TFT_B2: FPC1.23 U16.150(PD6)
TFT_B3: FPC1.24 U16.154(PG11)
TFT_B4: FPC1.25 U16.173(PI4)
TFT_B5: FPC1.26 U16.47(PA3)
TFT_B6: FPC1.27 U16.167(PB8)
TFT_B7: FPC1.28 U16.168(PB9)
TFT_CLK: FPC1.30 U16.111(PG7)
TFT_DE: FPC1.34 U16.28(PF10)
TFT_G0: FPC1.13 U16.4(PE5)
TFT_G1: FPC1.14 U16.5(PE6)
TFT_G2: FPC1.15 U16.128(PH13)
TFT_G3: FPC1.16 U16.153(PG10)
TFT_G4: FPC1.17 U16.130(PH15)
TFT_G5: FPC1.18 U16.131(PI0)
TFT_G6: FPC1.19 U16.116(PC7)
TFT_G7: FPC1.20 U16.133(PI2)
TFT_HS: FPC1.32 U16.12(PI10)
TFT_R0: FPC1.5 U16.43(PH2)
TFT_R1: FPC1.6 U16.44(PH3)
TFT_R2: FPC1.7 U16.85(PH8)
TFT_R3: FPC1.8 U16.56(PB0)
TFT_R4: FPC1.9 U16.122(PA11)
TFT_R5: FPC1.10 U16.123(PA12)
TFT_R6: FPC1.11 U16.57(PB1)
TFT_R7: FPC1.12 U16.110(PG6)
TFT_VS: FPC1.33 U16.11(PI9)
UP: C9.1 H3.8 R26.1
$1N3775: LED1.2(-) U4.1(AN)
$1N3780: R4.1 U4.3(CAT)
$1N3785: LED2.2(-) U5.1(AN)
$1N3790: R6.1 U5.3(CAT)
$1N3795: LED3.2(-) U6.1(AN)
$1N3802: LED4.2(-) U7.1(AN)
$1N3807: R10.1 U7.3(CAT)
$1N3812: LED5.2(-) U8.1(AN)
$1N3817: R12.1 U8.3(CAT)
$1N3822: LED6.2(-) U9.1(AN)
$1N3827: R14.1 U9.3(CAT)
$1N3837: R16.1 U10.3(CAT)
$1N3847: R18.1 U11.3(CAT)
$1N3857: R20.1 U12.3(CAT)
$1N3867: R22.1 U13.3(CAT)
$1N3874: R8.1 U6.3(CAT)
$1N8570: C4.1 U3.1(BOOT)
$1N8571: C4.2 D1.1(K) L1.1 U3.8(PH)
$1N8573: R2.1 R3.2 U3.4(VSENSE)
$1N21682: D2.2(A) L2.2 U17.1(SW)
$2N1437: C33.2 U16.81(VCAP_1)
$2N1788: R1.1 U16.58(PB2-BOOT1(PB2))
$2N1827: R36.1 U16.166(BOOT0)
$2N1864: R37.1 U16.171(PDR_ON)
$2N4096: C34.2 U16.125(VCAP_2)

Not connected (* = marked no-connect by the designer): FPC1 3* 35* 37* 38* 39* 40*; SW7 2 4; U3 2(NC)* 3(NC)* 5(ENA)* 9(EP)*; U14 40(NC)*; U16 1(PE2)* 7(PI8)* 8(PC13)* 9(PC14-OSC32_IN(PC14))* 10(PC15-OSC32_OUT(PC15))* 13(PI11)* 24(PF6)* 25(PF7)* 26(PF8)* 27(PF9)* 33(PC1)* 34(PC2)* 35(PC3)* 40(PA0-WKUP(PA0))* 42(PA2)* 45(PH4)* 46(PH5)* 50(PA4)* 51(PA5)* 52(PA6)* 53(PA7)* 54(PC4)* 55(PC5)* 79(PB10)* 80(PB11)* 86(PH9)* 89(PH12)* 92(PB12)* 94(PB14)* 95(PB15)* 99(PD11)* 100(PD12)* 101(PD13)* 107(PG3)* 118(PC9)* 120(PA9)* 141(PC12)* 146(PD4)* 147(PD5)* 151(PD7)* 152(PG9)* 156(PG13)* 157(PG14)* 161(PB3(JTDO/TRACESWO))* 164(PB6)* 165(PB7)* 174(PI5)* 176(PI7)*

## Notes on the sheets
sheet 1
- 预留输入和输出
- 电源模块
- 步进电机输入控制
- 纠偏和限位信号
- 步进电机输出控制
